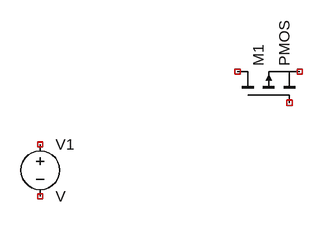
[diagram p0: schematic polaridad inversa.asc]
polaridad inversa.asc, the LTspice schematic file:
Version 4
SHEET 1 880 680
SYMBOL pmos 192 192 R270
SYMATTR InstName M1
SYMBOL voltage -112 240 R0
SYMATTR InstName V1

The netlist it stands for:
* polaridad inversa.asc
M1 NC_01 NC_02 NC_03 NC_03 PMOS
V1 NC_04 NC_05 V
.model NMOS NMOS
.model PMOS PMOS
.lib standard.mos
.backanno
.end